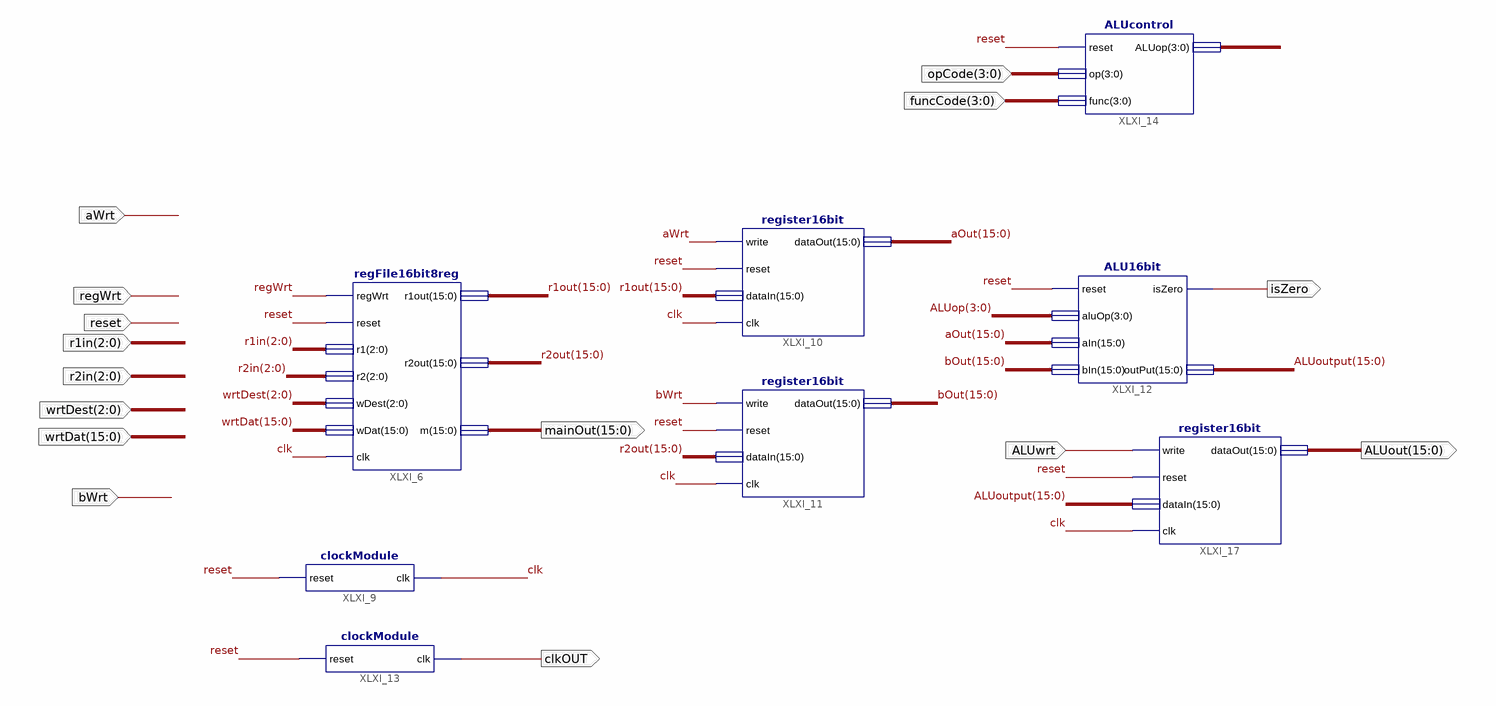
[diagram p0: schematic sheet 1]
// Xilinx ISE schematic F_regandALU.sch (spartan3e) as structural Verilog: 8 symbols, 15 ports
module F_regandALU (
  input  reset,
  input  regWrt,
  input  [2:0] r1in,
  input  [2:0] r2in,
  input  [2:0] wrtDest,
  input  [15:0] wrtDat,
  input  bWrt,
  input  aWrt,
  input  [3:0] opCode,
  input  [3:0] funcCode,
  input  ALUwrt,
  output [15:0] mainOut,
  output clkOUT,
  output isZero,
  output [15:0] ALUout
);

  wire clk;
  wire [3:0] ALUop;
  wire [15:0] ALUoutput, aOut, bOut, r1out, r2out;

  regFile16bit8reg XLXI_6 (
    .regWrt(regWrt), .reset(reset), .r1(r1in), .r2(r2in), .wDest(wrtDest), .wDat(wrtDat), .r1out(r1out),
    .r2out(r2out), .m(mainOut), .clk(clk));
  clockModule XLXI_9 (.reset(reset), .clk(clk));
  register16bit XLXI_10 (.write(aWrt), .reset(reset), .dataIn(r1out), .dataOut(aOut), .clk(clk));
  register16bit XLXI_11 (.write(bWrt), .reset(reset), .dataIn(r2out), .dataOut(bOut), .clk(clk));
  clockModule XLXI_13 (.reset(reset), .clk(clkOUT));
  ALUcontrol XLXI_14 (.reset(reset), .op(opCode), .func(funcCode), .ALUop(ALUop));
  ALU16bit XLXI_12 (.reset(reset), .aluOp(ALUop), .aIn(aOut), .bIn(bOut), .isZero(isZero), .outPut(ALUoutput));
  register16bit XLXI_17 (.write(ALUwrt), .reset(reset), .dataIn(ALUoutput), .dataOut(ALUout), .clk(clk));
endmodule
